# Altium schematic sheet top.SchDoc: Test
size A4; Author: Łukasz Przeniosło; Organization: PRZENIOSLO; Address1: Electronics; Address2: &; Address3: Software; DocumentNumber: 1; Revision: 1.0; SheetNumber: 1; SheetTotal: 3
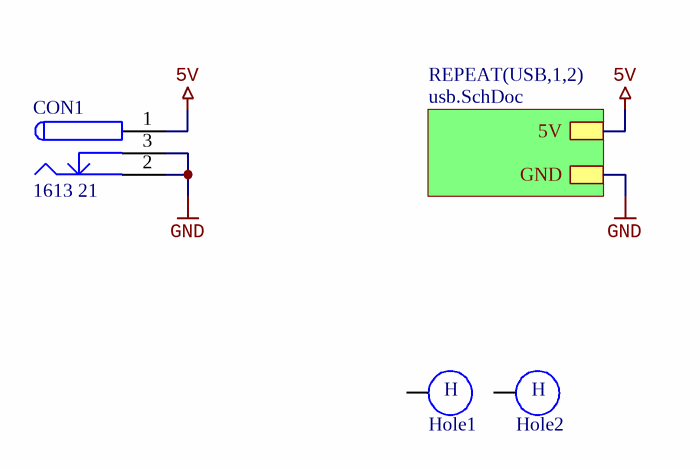
[diagram p0: top.SchDoc]

## Parts
CON1  1613 21  [JACK-2.5]
Hole1  Hole  [HOLE-6/3.2]  (value not drawn)
Hole2  Hole  [HOLE-6/3.2]  (value not drawn)

## Sub-sheets
REPEAT(USB,1,2) = usb.SchDoc: 5V, GND

## Nets
5V: CON1.1 ; sheet REPEAT(USB,1,2)/5V
GND: CON1.2 CON1.3 ; sheet REPEAT(USB,1,2)/GND

Not connected (* = marked no-connect by the designer): Hole1 1; Hole2 1

## Notes on the sheet
- Title:
- Date:
- Author:
- Project:
- Time:
- Sheet
- of
- File:
- (in symbol HOLE_) H

## Library data of the parts
CON1 = JACK-2.5: Low Voltage Power Supply Connector; manid: 1613 21
Hole1 Hole2 = HOLE_